# EAGLE design ZenithController (EAGLE 9.6.2)
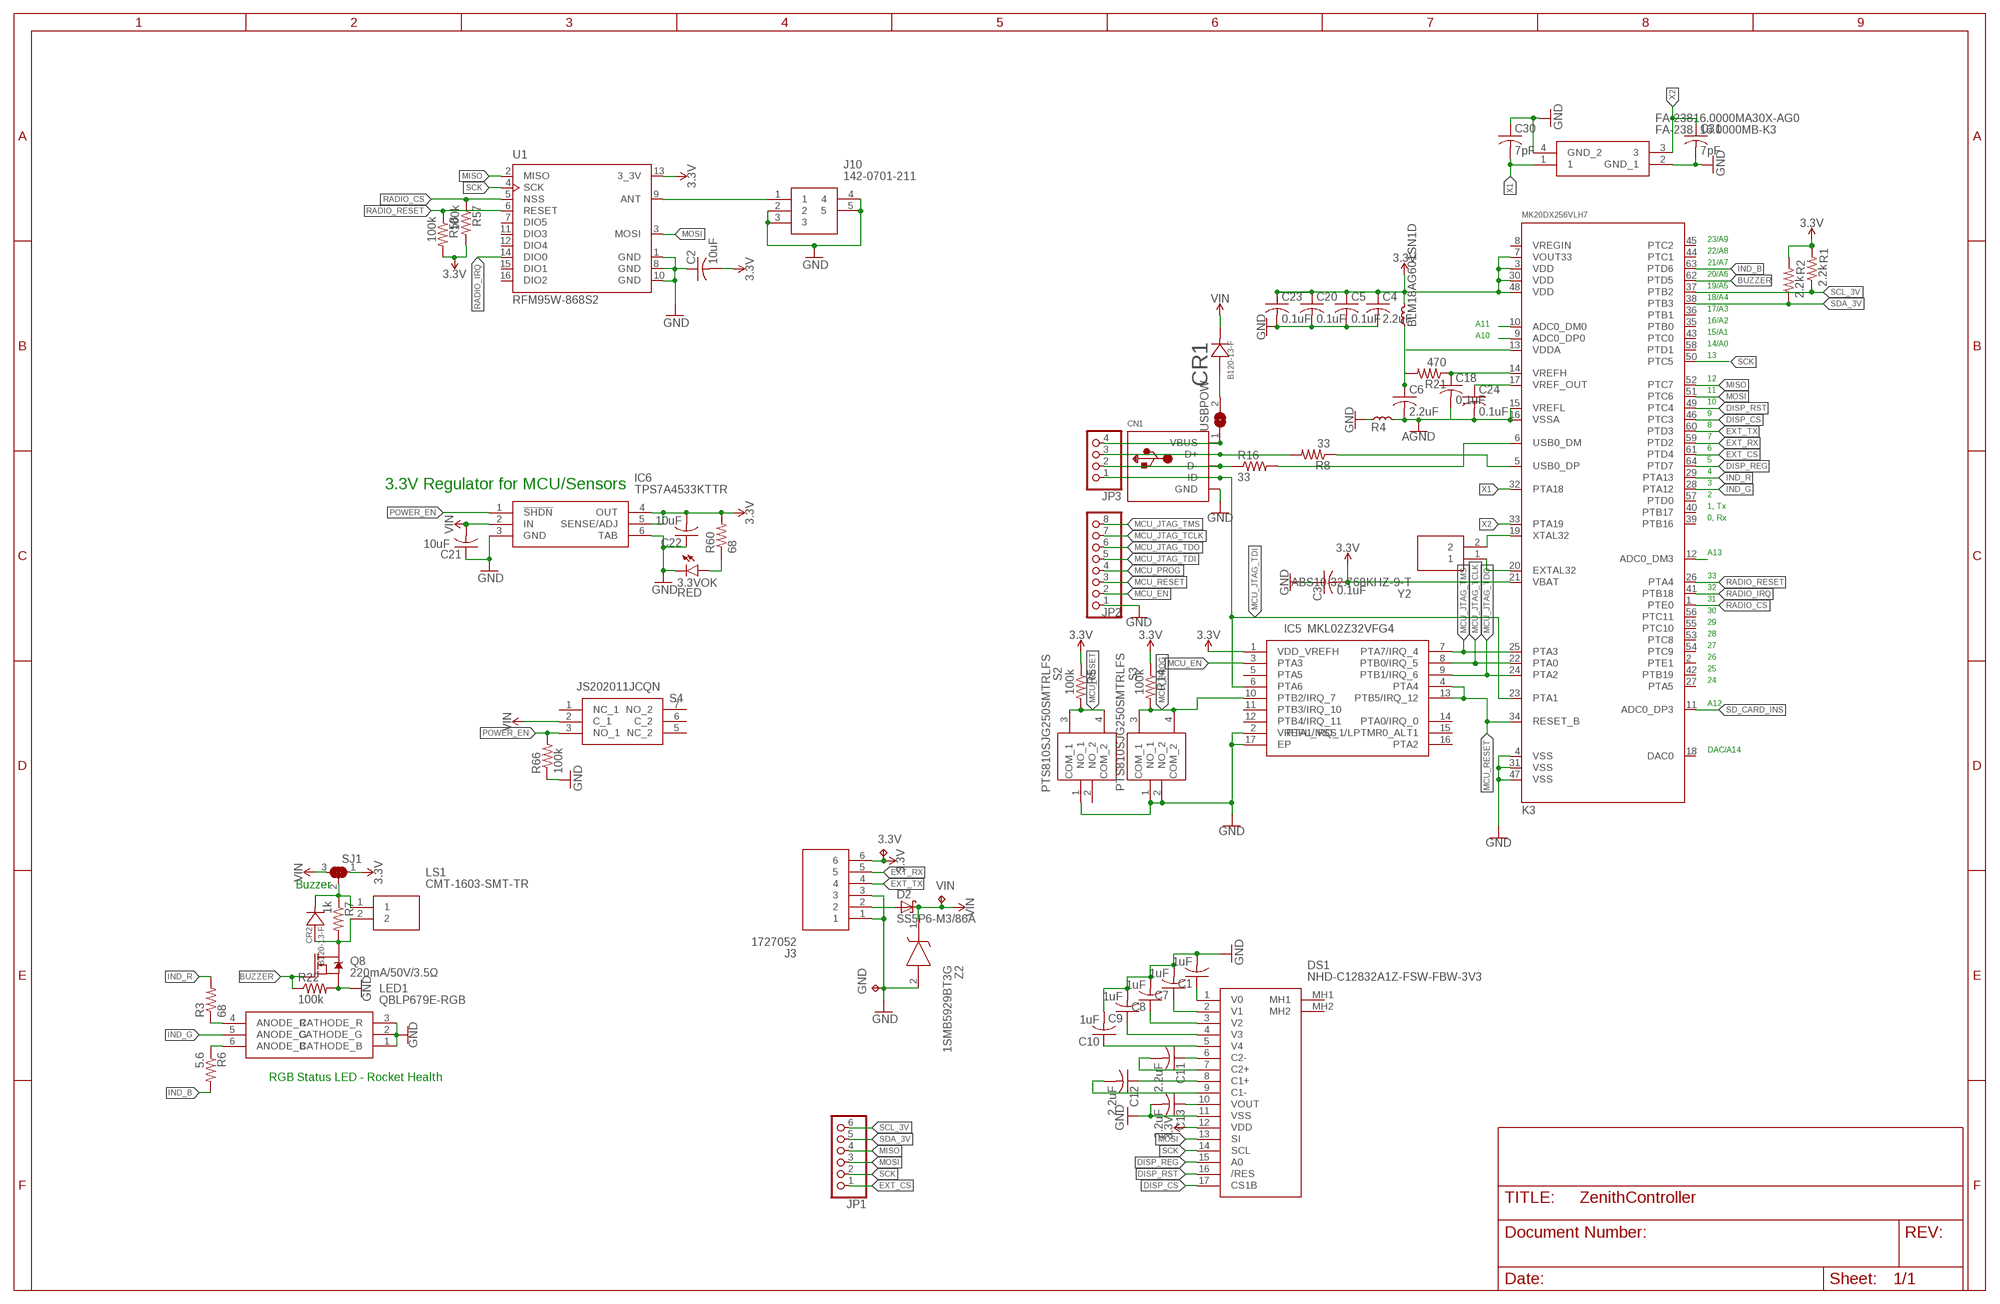
[diagram p0: schematic, sheet 1]

## Parts
3.3V  TPB1,27  [B1,27]
3.3VOK  RED  LEDCHIP-LED0805  [CHIP-LED0805]
BLM18AG601SN1D  FERRITE  [L0603]
C1  1uF  C-USC0603  [C0603]
C2  10uF  C-USC0603  [C0603]
C3  0.1uF  C-USC0603  [C0603]
C4  2.2uF  C-USC0603  [C0603]
C5  0.1uF  C-USC0603  [C0603]
C6  2.2uF  C-USC0603  [C0603]
C7  1uF  C-USC0603  [C0603]
C8  1uF  C-USC0603  [C0603]
C9  1uF  C-USC0603  [C0603]
C10  1uF  C-USC0603  [C0603]
C11  2.2uF  C-USC0603  [C0603]
C12  2.2uF  C-USC0603  [C0603]
C13  2.2uF  C-USC0603  [C0603]
C18  0.1uF  C-USC0603  [C0603]
C20  0.1uF  C-USC0603  [C0603]
C21  10uF  C-USC0603  [C0603]
C22  10uF  C-USC0603  [C0603]
C23  0.1uF  C-USC0603  [C0603]
C24  0.1uF  C-USC0603  [C0603]
C30  7pF  C-USC0603  [C0603]
C31  7pF  C-USC0603  [C0603]
CN1  USBMINIB  [USB-MINIB]
CR1  B120-13-F  [SMA_DIO]
CR2  B120-13-F  [SMA_DIO]
D2  SS5P6-M3/86A  [TO-277A(SMPC)]
DS1  NHD-C12832A1Z-FSW-FBW-3V3  [NHDC12832A1ZFSWFBW3V3]
FA-23816.0000MA30X-AG0  FA-238_16.0000MB-K3  [EPSON-FA-238]
GND  TPB1,27  [B1,27]
IC5  MKL02Z32VFG4  [QFN50P300X300X65-17N]
IC6  TPS7A4533KTTR  [KTT0005B]
J3  1727052  [SHDR6W105P0X381_1X6_2285X730X8]
J10  142-0701-211  [1420701211]
JP1  PINHD-1X6  [1X06]
JP2  PINHD-1X8  [1X08]
JP3  PINHD-1X4  [1X04]
K3  MK20DX256VLH7  [LQFP64-05]
LED1  QBLP679E-RGB  [QBLP679ERGB]
LS1  CMT-1603-SMT-TR  [CMT1603SMTTR]
Q8  220mA/50V/3.5Ω  MOSFET-NCH-BSS138  [SOT23-3]
R1  2.2k  R-US_R0603  [R0603]
R2  2.2k  R-US_R0603  [R0603]
R3  68  R-US_R0603  [R0603]
R4  FERRITE  [L0603]
R5  100k  R-US_R0603  [R0603]
R6  5.6  R-US_R0603  [R0603]
R7  1k  R-US_R0603  [R0603]
R8  33  R-US_R0603  [R0603]
R14  100k  R-US_R0603  [R0603]
R16  33  R-US_R0603  [R0603]
R21  470  R-US_R0603  [R0603]
R22  100k  R-US_R0603  [R0603]
R57  100k  R-US_R0603  [R0603]
R58  100k  R-US_R0603  [R0603]
R60  68  R-US_R0603  [R0603]
R66  100k  R-US_R0603  [R0603]
S2  PTS810SJG250SMTRLFS  [PTS810SJG250SMTRLFS]
S3  PTS810SJG250SMTRLFS  [PTS810SJG250SMTRLFS]
S4  JS202011JCQN  [JS202011JCQN]
SJ1  SOLDERJUMPER_2WAY0603  [SOLDERJUMPER_2WAY_OPEN_0603]
U1  RFM95W-868S2  [XCVR_RFM95W-868S2]
USBPOW  SJ  [SJ]
VIN  TPB1,27  [B1,27]
Y2  ABS10-32.768KHZ-9-T  [ABS-10]
Z2  1SMB5929BT3G  [DIOM5436X247N]

## Nets
3.3V [ICPower]: 3.3V.TP BLM18AG601SN1D.2 C2.2 C3.2 C4.1 C5.1 C20.1 C22.2 C23.1 DS1.12(VDD) IC5.1(VDD_VREFH) IC6.4(OUT) IC6.5(SENSE/ADJ) J3.6 K3.3(VDD) K3.7(VOUT33) K3.21(VBAT) K3.30(VDD) K3.48(VDD) R1.2 R2.2 R5.1 R14.1 R57.2 R58.2 R60.2 SJ1.1 U1.13(3_3V)
AGND: C6.2 C18.2 C24.2 K3.15(VREFL) K3.16(VSSA) R4.2
BUZZER: K3.62(PTD5) Q8.1(G) R22.1
DISP_CS: DS1.17(CS1B) K3.46(PTC3)
DISP_REG: DS1.15(A0) K3.64(PTD7)
DISP_RST: DS1.16(/RES) K3.49(PTC4)
EXT_CS: JP1.1 K3.61(PTD4)
EXT_RX: J3.5 K3.59(PTD2)
EXT_TX: J3.4 K3.60(PTD3)
GND [ICPower]: 3.3VOK.C C1.2 C2.1 C3.1 C4.2 C5.2 C7.2 C8.2 C9.2 C10.2 C13.2 C20.2 C21.1 C22.1 C23.2 C30.1 C31.2 CN1.GND DS1.11(VSS) FA-23816.0000MA30X-AG0.2(GND_1) FA-23816.0000MA30X-AG0.4(GND_2) GND.TP IC5.2(VREFL_VSS) IC5.17(EP) IC6.3(GND) IC6.6(TAB) J3.1 J3.3 J10.2 J10.3 J10.4 J10.5 JP2.1 K3.4(VSS) K3.31(VSS) K3.47(VSS) LED1.1(CATHODE_B) LED1.2(CATHODE_G) LED1.3(CATHODE_R) Q8.2(S) R4.1 R22.2 R66.1 S2.1(NO_1) S3.1(NO_1) S3.2(NO_2) U1.1(GND) U1.8(GND) U1.10(GND) Z2.2(A)
IND_B [SemiHighPower]: K3.63(PTD6) R6.2
IND_G [SemiHighPower]: K3.28(PTA12) LED1.5(ANODE_G)
IND_R [SemiHighPower]: K3.29(PTA13) R3.2
MCU_EN: IC5.3(PTA3) JP2.2
MCU_JTAG_TCLK: IC5.8(PTB0/IRQ_5) JP2.7 K3.22(PTA0)
MCU_JTAG_TDI: CN1.ID IC5.6(PTA6) JP2.5 JP3.1 K3.23(PTA1)
MCU_JTAG_TDO: IC5.9(PTB1/IRQ_6) JP2.6 K3.24(PTA2)
MCU_JTAG_TMS: IC5.7(PTA7/IRQ_4) JP2.8 K3.25(PTA3)
MCU_PROG: IC5.10(PTB2/IRQ_7) JP2.4 R14.2 S3.3(COM_1) S3.4(COM_2)
MCU_RESET: IC5.4(PTA4) IC5.13(PTB5/IRQ_12) JP2.3 K3.34(RESET_B) R5.2 S2.3(COM_1) S2.4(COM_2)
MISO: JP1.4 K3.52(PTC7) U1.2(MISO)
MOSI: DS1.13(SI) JP1.3 K3.51(PTC6) U1.3(MOSI)
N$1: C1.1 DS1.1(V0)
N$2 [SemiHighPower]: LED1.4(ANODE_R) R3.1
N$3: K3.19(XTAL32) Y2.2
N$4: BLM18AG601SN1D.1 C6.1 R21.2
N$5: C7.1 DS1.2(V1)
N$6 [SemiHighPower]: LED1.6(ANODE_B) R6.1
N$7: CR2.2 LS1.2 Q8.3(D) R7.2
N$8: J10.1 U1.9(ANT)
N$9: C8.1 DS1.3(V2)
N$10: C24.1 K3.17(VREF_OUT)
N$11: 3.3VOK.A R60.1
N$12: C9.1 DS1.4(V3)
N$13: C10.1 DS1.5(V4)
N$14: C13.1 DS1.10(VOUT)
N$15: C11.1 DS1.6(C2-)
N$16: C11.2 DS1.7(C2+)
N$17: C12.1 DS1.8(C1+)
N$18: C12.2 DS1.9(C1-)
N$21: CN1.D+ JP3.3 R8.2
N$22: CN1.D- JP3.2 R16.1
N$23: K3.5(USB0_DP) R8.1
N$24: K3.6(USB0_DM) R16.2
N$25: CR1.2 USBPOW.2
N$27: CN1.VBUS JP3.4 USBPOW.1
N$29: K3.13(VDDA)
N$30: C18.1 K3.14(VREFH) R21.1
N$35: CR2.1 LS1.1 R7.1 SJ1.2
N$36 [Pyro]: D2.A1(A) D2.A2(A) J3.2
N$37: K3.20(EXTAL32) Y2.1
N$117: K3.12(ADC0_DM3)
N$129: K3.10(ADC0_DM0)
N$130: K3.9(ADC0_DP0)
POWER_EN: IC6.1(!SHDN) R66.2 S4.3(NO_1)
RADIO_CS: K3.1(PTE0) R57.1 U1.5(NSS)
RADIO_IRQ: K3.41(PTB18) U1.14(DIO0)
RADIO_RESET: K3.26(PTA4) R58.1 U1.6(RESET)
SCK: DS1.14(SCL) JP1.2 K3.50(PTC5) U1.4(SCK)
SCL_3V: JP1.6 K3.37(PTB2) R1.1
SD_CARD_INS: K3.11(ADC0_DP3)
SDA_3V: JP1.5 K3.38(PTB3) R2.1
VIN [Pyro]: C21.2 CR1.1 D2.K(C) IC6.2(IN) S4.2(C_1) SJ1.3 VIN.TP Z2.1(K)
X1: C30.2 FA-23816.0000MA30X-AG0.1 K3.32(PTA18)
X2: C31.1 FA-23816.0000MA30X-AG0.3 K3.33(PTA19)
Unconnected: DS1.MH1 DS1.MH2 IC5.5(PTA5) IC5.11(PTB3/IRQ_10) IC5.12(PTB4/IRQ_11) IC5.14(PTA0/IRQ_0) IC5.15(PTA1/IRQ_1/LPTMR0_ALT1) IC5.16(PTA2) K3.2(PTE1) K3.8(VREGIN) K3.18(DAC0) K3.27(PTA5) K3.35(PTB0) K3.36(PTB1) K3.39(PTB16) K3.40(PTB17) K3.42(PTB19) K3.43(PTC0) K3.44(PTC1) K3.45(PTC2) K3.53(PTC8) K3.54(PTC9) K3.55(PTC10) K3.56(PTC11) K3.57(PTD0) K3.58(PTD1) S2.2(NO_2) S4.1(NC_1) S4.5(NC_2) S4.6(C_2) S4.7(NO_2) U1.7(DIO5) U1.11(DIO3) U1.12(DIO4) U1.15(DIO1) U1.16(DIO2)

## Notes on the sheet
- 23/A9
- 22/A8
- 21/A7
- 20/A6
- 19/A5
- 18/A4
- 17/A3
- 16/A2
- A11
- 15/A1
- A10
- 14/A0
- 13
- 12
- 11
- 10
- 9
- 8
- 7
- 6
- 5
- 4
- 3
- 3.3V Regulator for MCU/Sensors
- 2
- 1, Tx
- 0, Rx
- A13
- 33
- 32
- 31
- 30
- 29
- 28
- 27
- 26
- 25
- 24
- A12
- DAC/A14
- Buzzer
- RGB Status LED - Rocket Health

## Library data of the parts
3.3V GND VIN = testpad:TP: Test pad
3.3VOK = led:LED: LED OSRAM: - CHIPLED LG R971, LG N971, LY N971, LG Q971, LY Q971, LO R971, LY R971 LH N974, LH R974 LS Q976, LO Q976, LY Q976 LO Q996 - Hyper CHIPLED LW Q18S LB Q993, LB Q99A, LB R99A - SideLED LS A670, LO A670, LY A670, LG A670, LP A670 LB A673, LV A673, LT A673, LW A673 LH A674 LY A675 LS A676, LA A676, LO A676, LY A676, LW A676 LS A679, LY A679, LG A679 - Hyper Micro SIDELED® LS Y876, LA Y876, LO Y876, LY Y876 LT Y87S - SmartLED LW L88C, LW L88S LB L89C, LB L89S, LG L890 LS L89K, LO L89K, LY L89K LS L896, LA L896, LO L896, LY L896 - TOPLED LS T670, LO T670, LY T670, LG T670, LP T670 LSG T670, LSP T670, LSY T670, LOP T670, LYG T670 LG T671, LOG T671, LSG T671 LB T673, LV T673, LT T673, LW T673 LH T674 LS T676, LA T676, LO T676, LY T676, LB T676, LH T676, LSB T676, LW T676 LB T67C, LV T67C, LT T67C, LS T67K, LO T67K, LY T67K, LW E67C LS E67B, LA E67B, LO E67B, LY E67B, LB E67C, LV E67C, LT E67C LW T67C LS T679, LY T679, LG T679 LS T770, LO T770, LY T770, LG T770, LP T770 LB T773, LV T773, LT T773, LW T773 LH T774 LS E675, LA E675, LY E675, LS T675 LS T776, LA T776, LO T776, LY T776, LB T776 LHGB T686 LT T68C, LB T68C - Hyper Mini TOPLED® LB M676 - Mini TOPLED Santana® LG M470 LS M47K, LO M47K, LY M47K Source: http://www.osram.convergy.de LUXEON: - LUMILED® LXK2-PW12-R00, LXK2-PW12-S00, LXK2-PW14-U00, LXK2-PW14-V00 LXK2-PM12-R00, LXK2-PM12-S00, LXK2-PM14-U00 LXK2-PE12-Q00, LXK2-PE12-R00, LXK2-PE12-S00, LXK2-PE14-T00, LXK2-PE14-U00 LXK2-PB12-K00, LXK2-PB12-L00, LXK2-PB12-M00, LXK2-PB14-N00, LXK2-PB14-P00, LXK2-PB14-Q00 LXK2-PR12-L00, LXK2-PR12-M00, LXK2-PR14-Q00, LXK2-PR14-R00 LXK2-PD12-Q00, LXK2-PD12-R00, LXK2-PD12-S00 LXK2-PH12-R00, LXK2-PH12-S00 LXK2-PL12-P00, LXK2-PL12-Q00, LXK2-PL12-R00 Source: www.luxeon.com KINGBRIGHT: KA-3528ASYC Source: www.kingbright.com
BLM18AG601SN1D R4 = t32_ref:FERRITE; DESC: 600R / 100MHz; MF: Murata Electronics; MPN: BLM18AG601SN1D; OC_MOUSER: 81-BLM11A601S; PACKAGE: 0603; TYPE: Ferrite
C1-C13 C18 C20-C24 C30 C31 = rcl:C-US: CAPACITOR, American symbol; SPICEPREFIX: C
CN1 = adafruit:USB: USB Connectors USBMINIB - Surface Mount Female Mini-B USB Connector 4UConnector: 06564 By microbuilder.eu Thru-hole RA Female Mini-B USB Connector 4UConnector: 18732 By ladyada.net
CR1 CR2 = B120-13-F:B120-13-F; BUILT_BY: EMA_UL_Team; MANUFACTURER_PART_NUMBER: B120-13-F; SOURCELIBRARY: DiodesInc_2015-05-08; VENDOR: Diodes Inc
D2 = SS5P6-M3_86A:SS5P6-M3/86A: Vishay SS5P6-M3/86A 60V 5A; ARROW_ELECTRONICS-PURCHASE-URL: https://snapeda.com/shop?store=Arrow+Electronics&id=580592; AVAILABILITY: Unavailable; DESCRIPTION: Diode Schottky 60V 5A Surface Mount TO-277A (SMPC); DIGIKEY-PURCHASE-URL: https://snapeda.com/shop?store=DigiKey&id=580592; MF: Vishay Semiconductor; MOUSER-PURCHASE-URL: https://snapeda.com/shop?store=Mouser&id=580592; MP: SS5P6-M3/86A; PACKAGE: TO-277 Vishay Semiconductor; PRICE: None
DS1 = SamacSys_Parts:NHD-C12832A1Z-FSW-FBW-3V3: LCD Graphic Display Modules & Accessories FSTN (+) 41.4 x 24.3 x 4.0 Source: Datasheet <https://www.newhavendisplay.com/specs/NHD-C12832A1Z-FSW-FBW-3V3.pdf>; ARROW_PART_NUMBER: NHD-C12832A1Z-FSW-FBW-3V3; DESCRIPTION: LCD Graphic Display Modules & Accessories FSTN (+) 41.4 x 24.3 x 4.0; HEIGHT: 4.3mm; MANUFACTURER_NAME: Newhaven Display; MANUFACTURER_PART_NUMBER: NHD-C12832A1Z-FSW-FBW-3V3; MOUSER_PART_NUMBER: 763-C12832A1ZFSWFBW3; MOUSER_PRICE-STOCK: https://www.mouser.co.uk/ProductDetail/Newhaven-Display/NHD-C12832A1Z-FSW-FBW-3V3?qs=Vb5qD4CGh4nSmlh9l2%252Byrw%3D%3D
FA-23816.0000MA30X-AG0 = SamacSys_Parts:FA-238_16.0000MB-K3: Crystal 16MHz Source: Datasheet <https://support.epson.biz/td/api/doc_check.php?dl=brief_fa-238v_en.pdf>; ARROW_PART_NUMBER: FA-238 16.0000MB-K3; ARROW_PRICE-STOCK: https://www.arrow.com/en/products/fa-23816.0000mb-k3/epson-electronics-america; DESCRIPTION: Crystal 16MHz; HEIGHT: mm; MANUFACTURER_NAME: Epson Timing; MANUFACTURER_PART_NUMBER: FA-238 16.0000MB-K3; MOUSER_PART_NUMBER: 732-FA238-16B-K3; MOUSER_PRICE-STOCK: https://www.mouser.co.uk/ProductDetail/Epson-Timing/FA-238-160000MB-K3?qs=CANAagUtPAoF3w0fRAI0xg%3D%3D
IC5 = SamacSys_Parts:MKL02Z32VFG4: NXP MKL02Z32VFG4, 32bit ARM Cortex M0 Microcontroller, 48MHz, 32 kB Flash, 16-Pin QFN Source: Datasheet <http://www.nxp.com/docs/en/data-sheet/KL02P32M48SF0.pdf>; ARROW_PART_NUMBER: MKL02Z32VFG4; ARROW_PRICE-STOCK: https://www.arrow.com/en/products/mkl02z32vfg4/nxp-semiconductors; DESCRIPTION: NXP MKL02Z32VFG4, 32bit ARM Cortex M0 Microcontroller, 48MHz, 32 kB Flash, 16-Pin QFN; HEIGHT: 0.65mm; MANUFACTURER_NAME: NXP; MANUFACTURER_PART_NUMBER: MKL02Z32VFG4; MOUSER_PART_NUMBER: 841-MKL02Z32VFG4; MOUSER_PRICE-STOCK: https://www.mouser.co.uk/ProductDetail/NXP-Semiconductors/MKL02Z32VFG4?qs=RECgZY%252BK1xLpPFD7GzHxWg%3D%3D
IC6 = SamacSys_Parts:TPS7A4533KTTR: Low-Noise Fast-Transient-Response 1.5-A Low-Dropout Voltage Regulators Source: Datasheet <http://www.ti.com/lit/gpn/tps7a45>; ARROW_PART_NUMBER: TPS7A4533KTTR; ARROW_PRICE-STOCK: https://www.arrow.com/en/products/tps7a4533kttr/texas-instruments; DESCRIPTION: Low-Noise Fast-Transient-Response 1.5-A Low-Dropout Voltage Regulators; HEIGHT: mm; MANUFACTURER_NAME: Texas Instruments; MANUFACTURER_PART_NUMBER: TPS7A4533KTTR; MOUSER_PART_NUMBER: 595-TPS7A4533KTTR; MOUSER_PRICE-STOCK: https://www.mouser.co.uk/ProductDetail/Texas-Instruments/TPS7A4533KTTR?qs=VdEABdpqjWy1AK9ieQmsYg%3D%3D
J3 = SamacSys_Parts:1727052: PHOENIX CONTACT - 1727052 - TERMINAL BLOCK, WIRE TO BRD, 6POS, 16AWG Source: Datasheet <https://www.phoenixcontact.com/online/portal/gb/?uri=pxc-oc-itemdetail:pid=1727052&library=gben&pcck=P-11-01-05&tab=1&selectedCategory=ALL>; ARROW_PART_NUMBER: 1727052; ARROW_PRICE-STOCK: https://www.arrow.com/en/products/1727052/phoenix-contact; DESCRIPTION: PHOENIX CONTACT - 1727052 - TERMINAL BLOCK, WIRE TO BRD, 6POS, 16AWG; HEIGHT: 8.65mm; MANUFACTURER_NAME: Phoenix Contact; MANUFACTURER_PART_NUMBER: 1727052; MOUSER_PART_NUMBER: 651-1727052; MOUSER_PRICE-STOCK: https://www.mouser.co.uk/ProductDetail/Phoenix-Contact/1727052?qs=WWq3Ki8dym7VpMyTMk0i8A%3D%3D
J10 = SamacSys_Parts:142-0701-211: Cinch Connectors Straight 50 PCB Mount SMA Connector, jack, Solder Termination Source: Datasheet <https://media.digikey.com/pdf/Data Sheets/Emerson PDFs/142-0701-211, 216, 217.pdf>; ARROW_PART_NUMBER: 142-0701-211; ARROW_PRICE-STOCK: https://www.arrow.com/en/products/142-0701-211/cinch-connectivity-solutions; DESCRIPTION: Cinch Connectors Straight 50 PCB Mount SMA Connector, jack, Solder Termination; HEIGHT: 9.652mm; MANUFACTURER_NAME: Cinch Connectivity Solutions; MANUFACTURER_PART_NUMBER: 142-0701-211; MOUSER_PART_NUMBER: 530-1420701211; MOUSER_PRICE-STOCK: https://www.mouser.co.uk/ProductDetail/Johnson-Cinch-Connectivity-Solutions/142-0701-211?qs=VqHsQWpF6ulG8WyKOf%2FLqg%3D%3D
JP1 = pinhead:PINHD-1X6: PIN HEADER
JP2 = pinhead:PINHD-1X8: PIN HEADER
JP3 = pinhead:PINHD-1X4: PIN HEADER
K3 = t32_ref:MK20DX256VLH7; DESC: MK20DX256VLH7; MF: NXP; MPN: MK20DX256VLH7; OC_MOUSER: 841-MK20DX256VLH7; PACKAGE: LQFP-64; TYPE: Microcontroller
LED1 = SamacSys_Parts:QBLP679E-RGB: LED RGB DIFFUSED 6PLCC SMD Source: Datasheet <http://www.qt-brightek.com/datasheet/QBLP679E-RGB.pdf>; ARROW_PART_NUMBER: QBLP679E-RGB; DESCRIPTION: LED RGB DIFFUSED 6PLCC SMD; HEIGHT: 1.8mm; MANUFACTURER_NAME: QT Brightek (QTB); MANUFACTURER_PART_NUMBER: QBLP679E-RGB
LS1 = SamacSys_Parts:CMT-1603-SMT-TR: AUDIO PIEZO TRANSDUCER 25V SMD Source: Datasheet <https://componentsearchengine.com/Datasheets/1/CMT-1603-SMT-TR.pdf>; ARROW_PART_NUMBER: CMT-1603-SMT-TR; ARROW_PRICE-STOCK: https://www.arrow.com/en/products/cmt-1603-smt-tr/cui-devices; DESCRIPTION: AUDIO PIEZO TRANSDUCER 25V SMD; HEIGHT: 2.8mm; MANUFACTURER_NAME: CUI Devices; MANUFACTURER_PART_NUMBER: CMT-1603-SMT-TR; MOUSER_PART_NUMBER: 490-CMT-1603-SMT-TR; MOUSER_PRICE-STOCK: https://www.mouser.co.uk/ProductDetail/CUI-Devices/CMT-1603-SMT-TR?qs=WyjlAZoYn50AZ4xT4ox6zw%3D%3D
Q8 = SparkFun-DiscreteSemi:MOSFET-NCH: N-channel MOSFETs Voltage controlled devices that allow control of high current outputs. SparkFun Products: SparkFun OpenScale <https://www.sparkfun.com/products/13261> SparkFun Digital Sandbox <https://www.sparkfun.com/products/12651> SparkFun Monster Moto Shield <https://www.sparkfun.com/products/10182> SparkFun MOSFET Power Controller <https://www.sparkfun.com/products/11214>; PROD_ID: TRANS-00830
R1-R3 R5-R8 R14 R16 R21 R22 R57 R58 R60 R66 = rcl:R-US_: RESISTOR, American symbol; SPICEPREFIX: R
S2 S3 = SamacSys_Parts:PTS810SJG250SMTRLFS: PTS810SJG250SMTRLFS (Tactile Switches) Switch Tactile N.O. SPST Button J-Bend 0.05A 16VDC 100000Cycles 3.92N SMD T/R Source: Datasheet <https://www.ckswitches.com/media/1476/pts810.pdf>; ARROW_PART_NUMBER: PTS810SJG250SMTRLFS; DESCRIPTION: PTS810SJG250SMTRLFS (Tactile Switches) Switch Tactile N.O. SPST Button J-Bend 0.05A 16VDC 100000Cycles 3.92N SMD T/R; HEIGHT: 2.7mm; MANUFACTURER_NAME: C & K COMPONENTS; MANUFACTURER_PART_NUMBER: PTS810SJG250SMTRLFS; MOUSER_PART_NUMBER: 611-PTS810SJG250SMTR; MOUSER_PRICE-STOCK: https://www.mouser.co.uk/ProductDetail/CK/PTS810SJG250SMTRLFS?qs=UxeAxwACbqndUPIQjZosiw%3D%3D
S4 = SamacSys_Parts:JS202011JCQN: Slide Switch DPDT Surface Mount Source: Datasheet <https://www.ckswitches.com/media/1422/js.pdf>; ARROW_PART_NUMBER: JS202011JCQN; ARROW_PRICE-STOCK: https://www.arrow.com/en/products/js202011jcqn/ck; DESCRIPTION: Slide Switch DPDT Surface Mount; HEIGHT: 5mm; MANUFACTURER_NAME: C & K COMPONENTS; MANUFACTURER_PART_NUMBER: JS202011JCQN; MOUSER_PART_NUMBER: 611-JS202011JCQN; MOUSER_PRICE-STOCK: https://www.mouser.co.uk/ProductDetail/CK/JS202011JCQN?qs=74EMXstkWMXJzVJFnXPbEg%3D%3D
SJ1 = microbuilder:SOLDERJUMPER_2WAY: 2-Way Solder Jumper
U1 = RFM95W-868S2:RFM95W-868S2: Mod Txrx Lora +20dbm 868mhz Smd; AVAILABILITY: Unavailable; DESCRIPTION: General ISM < 1GHz LoRa™ Transceiver Module 868MHz Antenna Not Included Surface Mount; MF: RF; MP: RFM95W-868S2; PACKAGE: SMD-16 Hope Microelectronics; PRICE: None
USBPOW = jumper:SJ: SMD solder JUMPER
Y2 = SamacSys_Parts:ABS10-32.768KHZ-9-T: ABRACON - ABS10-32.768KHZ-9-T - Crystal, 32.768 kHz, SMD, 4.9mm x 1.8mm, 9 pF, 20 ppm, ABS10 Series Source: Datasheet <https://abracon.com/Resonators/ABS10.pdf>; ARROW_PART_NUMBER: ABS10-32.768KHZ-9-T; ARROW_PRICE-STOCK: https://www.arrow.com/en/products/abs10-32.768khz-9-t/abracon; DESCRIPTION: ABRACON - ABS10-32.768KHZ-9-T - Crystal, 32.768 kHz, SMD, 4.9mm x 1.8mm, 9 pF, 20 ppm, ABS10 Series; HEIGHT: mm; MANUFACTURER_NAME: ABRACON; MANUFACTURER_PART_NUMBER: ABS10-32.768KHZ-9-T; MOUSER_PART_NUMBER: 815-ABS10-32.768K9T; MOUSER_PRICE-STOCK: https://www.mouser.co.uk/ProductDetail/ABRACON/ABS10-32768KHZ-9-T?qs=76dmnhCH%2FMO8FcjiLkcQ2w%3D%3D
Z2 = SamacSys_Parts:1SMB5929BT3G: ON Semiconductor, 15V Zener Diode 5% 550 mW SMT 2-Pin SMB Source: Datasheet <https://www.onsemi.com/pub/Collateral/1SMB5913BT3-D.PDF>; ARROW_PART_NUMBER: 1SMB5929BT3G; ARROW_PRICE-STOCK: https://www.arrow.com/en/products/1smb5929bt3g/on-semiconductor; DESCRIPTION: ON Semiconductor, 15V Zener Diode 5% 550 mW SMT 2-Pin SMB; HEIGHT: 2.47mm; MANUFACTURER_NAME: ON Semiconductor; MANUFACTURER_PART_NUMBER: 1SMB5929BT3G; MOUSER_PART_NUMBER: 863-1SMB5929BT3G; MOUSER_PRICE-STOCK: https://www.mouser.co.uk/ProductDetail/ON-Semiconductor/1SMB5929BT3G?qs=vLkC5FC1VN%2FFUr7OS2Q1Aw%3D%3D

## Net classes
0 default: width 0.152 mm
2 ICPower: width 0.152 mm
3 Pyro: width 0.152 mm
4 SemiHighPower: width 0.152 mm

## Board
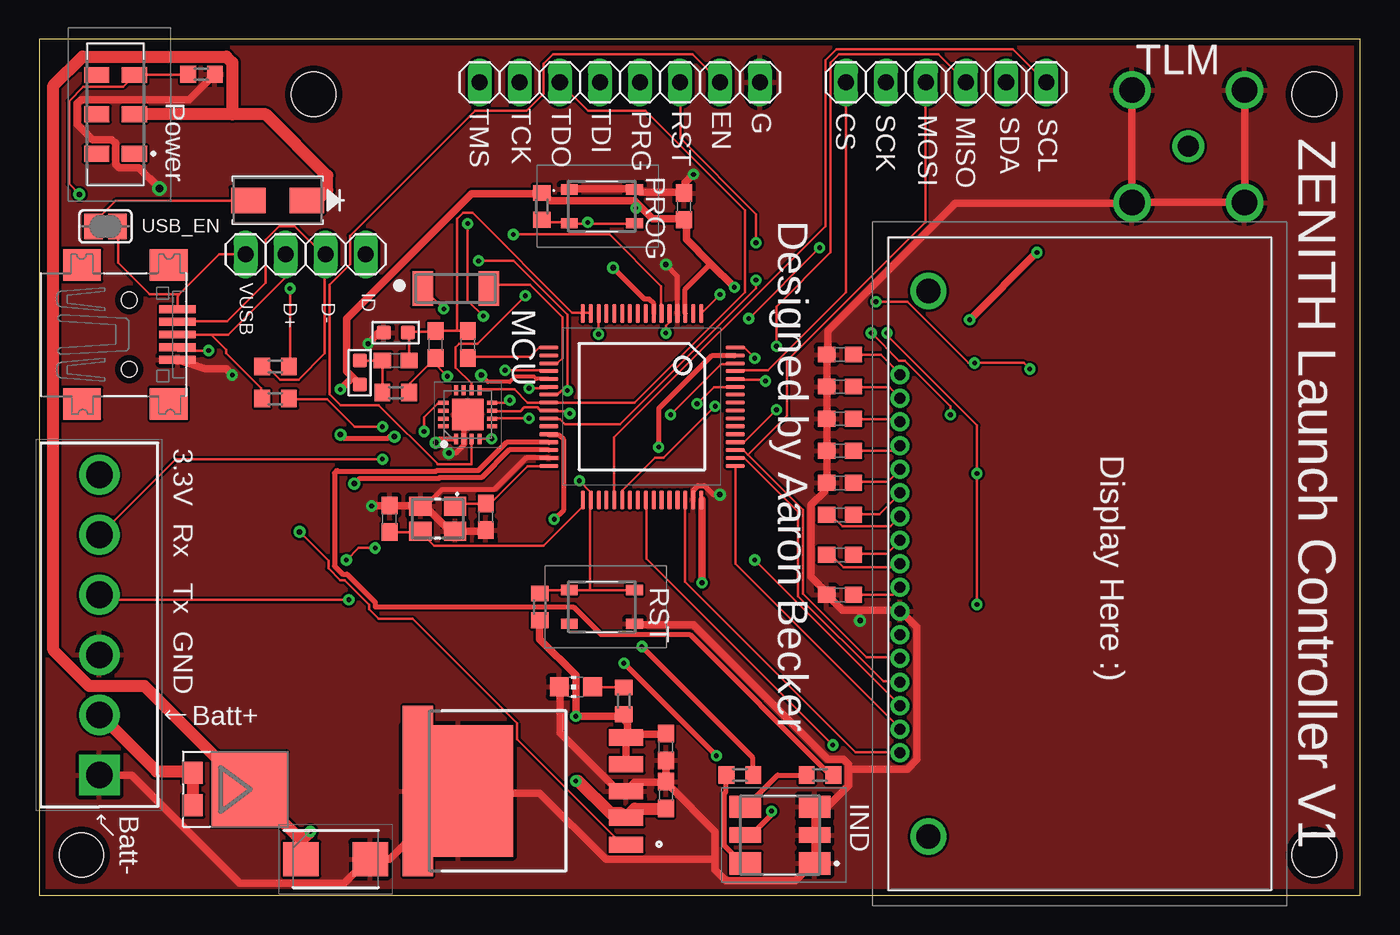
[diagram p1: board, top side]
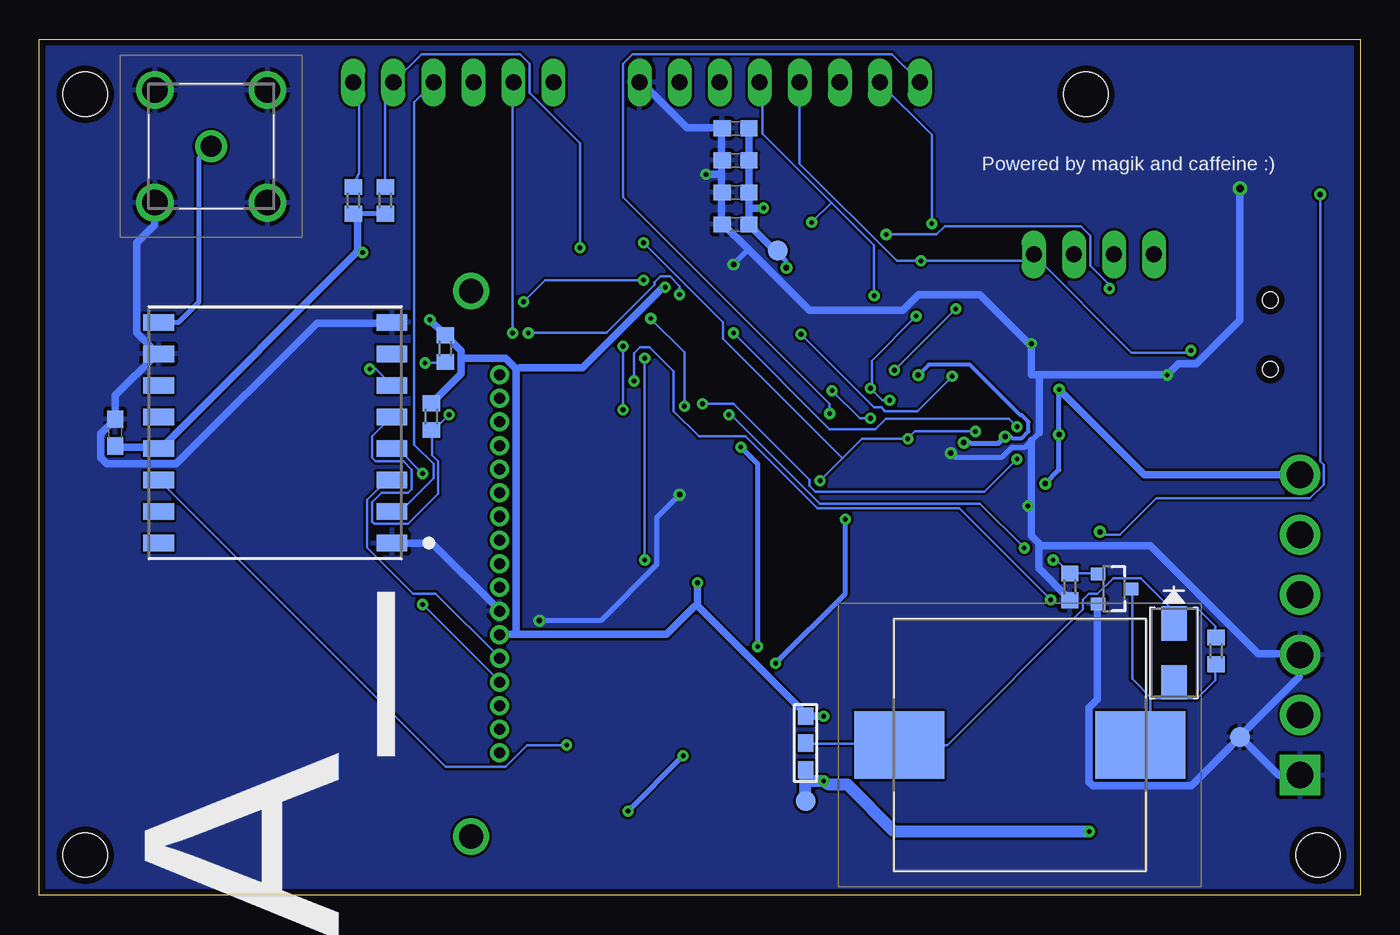
[diagram p2: board, bottom side, seen from below]

Size 83.8 x 54.28 mm. Coordinates in mm from the lower left corner, seen from the top.
Outline: 0,0 83.8,0 83.8,54.28 0,54.28 0,0
Copper layers (1*16): Top 0.035mm / dielectric 1.5mm / Bottom 0.035mm
Design rules "default *": minimum track width 6mil, minimum drill 0.3mm, track to track 6mil, track to pad 6mil, pad to pad 5mil, via to via 10mil, smd to smd 5mil, copper to edge 0.4mm, drill to drill 10mil, minimum pad ring 10mil, minimum via ring 8mil, stop-mask expansion 4mil, vias tented up to drill 0mil, thermal gap 10mil
Holes 2.8 mm at 2.67,2.54 80.9,2.54 17.4,50.8 80.9,50.8

### Footprints (pad centres in the part's own frame; a part is rotated, then mirrored left to right if it is on the bottom)
B1,27 = smd 1.27 x 1.27: TP 0,0
CHIP-LED0805 = smd 1.2 x 1.2: A 0,-1.05; C 0,1.05
L0603 = smd 0.889 x 0.889: 1 -0.762,0; 2 0.762,0
C0603 = smd 1.1 x 1: 1 -0.85,0; 2 0.85,0
USB-MINIB = smd 0.5 x 2.308: D+ 0,4.064; D- -0.8,4.064; GND 1.6,4.064; ID 0.8,4.064; VBUS -1.6,4.064 | smd 2 x 2.4: GND1 -4.4,-2; GND2 -4.4,3.5; GND3 4.4,3.5; GND4 4.4,-2 | hole 1: -2.2,1; 2.2,1
SMA_DIO = smd 2.18 x 1.63: 1 -1.857,0; 2 1.857,0
TO-277A(SMPC) = smd 1.4 x 1.3: A1 -1.04,-2.725; A2 1.04,-2.725 | smd 4.72 x 4.8: K 0,0.875
NHDC12832A1ZFSWFBW3V3 = drill 0.7 pad 1.2: 1 0,0; 2 1.5,0; 3 3,0; 4 4.5,0; 5 6,0; 6 7.5,0; 7 9,0; 8 10.5,0; 9 12,0; 10 13.5,0; 11 15,0; 12 16.5,0; 13 18,0; 14 19.5,0; 15 21,0; 16 22.5,0; 17 24,0 | drill 1.54 pad 2.31: MH1 -5.3,1.8; MH2 29.3,1.8
EPSON-FA-238 = smd 1.4 x 1.2: 1 -1.1,-0.8; 2 1.1,-0.8; 3 1.1,0.8; 4 -1.1,0.8
QFN50P300X300X65-17N = smd 0.65 x 0.25: 1 -1.55,0.75; 2 -1.55,0.25; 3 -1.55,-0.25; 4 -1.55,-0.75; 9 1.55,-0.75; 10 1.55,-0.25; 11 1.55,0.25; 12 1.55,0.75 | smd 0.25 x 0.65: 5 -0.75,-1.55; 6 -0.25,-1.55; 7 0.25,-1.55; 8 0.75,-1.55; 13 0.75,1.55; 14 0.25,1.55; 15 -0.25,1.55; 16 -0.75,1.55 | smd 2 x 2: 17 0,0
KTT0005B = smd 2.16 x 1.02: 1 12.461,-3.4; 2 12.461,-1.7; 3 12.461,0; 4 12.461,1.7; 5 12.461,3.4 | smd 6.99 x 8.33: 6 1.786,0 | smd 1.91 x 1.235: 7 -0.754,4.782; 8 -0.754,-4.782
SHDR6W105P0X381_1X6_2285X730X8 = drill 1.7 pad 2.55 square: 1 0,0 | drill 1.7 pad 2.55: 2 3.81,0; 3 7.62,0; 4 11.43,0; 5 15.24,0; 6 19.05,0
1420701211 = drill 1.346 pad 2.019: 1 0,0 | drill 1.6 pad 2.4: 2 -3.569,3.569; 3 -3.569,-3.569; 4 3.569,-3.569; 5 3.569,3.569
1X06 = drill 1.016 long: 1 -6.35,0; 2 -3.81,0; 3 -1.27,0; 4 1.27,0; 5 3.81,0; 6 6.35,0
1X08 = drill 1.016 long: 1 -8.89,0; 2 -6.35,0; 3 -3.81,0; 4 -1.27,0; 5 1.27,0; 6 3.81,0; 7 6.35,0; 8 8.89,0
1X04 = drill 1.016 long: 1 -3.81,0; 2 -1.27,0; 3 1.27,0; 4 3.81,0
LQFP64-05 = smd 1.2 x 0.25: 1 -5.915,3.759; 2 -5.915,3.251; 3 -5.915,2.743; 4 -5.915,2.261; 5 -5.915,1.753; 6 -5.915,1.245; 7 -5.915,0.762; 8 -5.915,0.254; 9 -5.915,-0.254; 10 -5.915,-0.762; 11 -5.915,-1.245; 12 -5.915,-1.753; 13 -5.915,-2.261; 14 -5.915,-2.743; 15 -5.915,-3.251; 16 -5.915,-3.759; 33 5.915,-3.759; 34 5.915,-3.251; 35 5.915,-2.743; 36 5.915,-2.261; 37 5.915,-1.753; 38 5.915,-1.245; 39 5.915,-0.762; 40 5.915,-0.254; 41 5.915,0.254; 42 5.915,0.762; 43 5.915,1.245; 44 5.915,1.753; 45 5.915,2.261; 46 5.915,2.743; 47 5.915,3.251; 48 5.915,3.759 | smd 0.25 x 1.2: 17 -3.759,-5.915; 18 -3.251,-5.915; 19 -2.743,-5.915; 20 -2.261,-5.915; 21 -1.753,-5.915; 22 -1.245,-5.915; 23 -0.762,-5.915; 24 -0.254,-5.915; 25 0.254,-5.915; 26 0.762,-5.915; 27 1.245,-5.915; 28 1.753,-5.915; 29 2.261,-5.915; 30 2.743,-5.915; 31 3.251,-5.915; 32 3.759,-5.915; 49 3.759,5.915; 50 3.251,5.915; 51 2.743,5.915; 52 2.261,5.915; 53 1.753,5.915; 54 1.245,5.915; 55 0.762,5.915; 56 0.254,5.915; 57 -0.254,5.915; 58 -0.762,5.915; 59 -1.245,5.915; 60 -1.753,5.915; 61 -2.261,5.915; 62 -2.743,5.915; 63 -3.251,5.915; 64 -3.759,5.915
QBLP679ERGB = smd 2 x 1.4: 1 2.2,-1.8; 3 2.2,1.8; 4 -2.2,1.8; 6 -2.2,-1.8 | smd 2 x 1: 2 2.2,0; 5 -2.2,0
CMT1603SMTTR = smd 5.7 x 4.3: 1 -7.65,0; 2 7.65,0
SOT23-3 = smd 0.8 x 0.9: 1 -0.95,-1; 2 0.95,-1; 3 0,1.1
R0603 = smd 1 x 1.1: 1 -0.85,0; 2 0.85,0
PTS810SJG250SMTRLFS = smd 1.05 x 0.65: 1 -2.075,1.075; 2 2.075,1.075; 3 -2.075,-1.075; 4 2.075,-1.075
JS202011JCQN = smd 1 x 1.6: 1 -2.5,-0.95; 2 0,-0.95; 3 2.5,-0.95; 5 2.5,1.45; 6 0,1.45; 7 -2.5,1.45
SOLDERJUMPER_2WAY_OPEN_0603 = smd 1.1 x 1: 1 -1.7,0; 2 0,0; 3 1.7,0
XCVR_RFM95W-868S2 = smd 1.95 x 1.05: 1 -7.4,7; 2 -7.4,5; 3 -7.4,3; 4 -7.4,1; 5 -7.4,-1; 6 -7.4,-3; 7 -7.4,-5; 8 -7.4,-7; 9 7.4,-7; 10 7.4,-5; 11 7.4,-3; 12 7.4,-1; 13 7.4,1; 14 7.4,3; 15 7.4,5; 16 7.4,7
SJ = smd 1.168 x 1.6: 1 -0.762,0; 2 0.762,0
ABS-10 = smd 1.3 x 2.2: 1 -2.1,0; 2 2.1,0
DIOM5436X247N = smd 2.25 x 2.15: 1 -2.2,0; 2 2.2,0

### Placement (x,y rotation side)
3.3V  36.96,40.89 0 bottom
3.3VOK  34.04,13.21 90 top
BLM18AG601SN1D  20.32,33.15 270 top
C1  50.8,34.29 180 top
C2  78.99,29.34 270 bottom
C3  40.89,43.69 270 top
C4  39.62,46.61 180 bottom
C5  39.62,48.64 180 bottom
C6  22.61,33.91 0 top
C7  50.8,32.26 180 top
C8  50.8,30.23 180 top
C9  50.8,28.19 180 top
C10  50.8,26.16 180 top
C11  50.8,24.13 180 top
C12  50.8,21.59 180 top
C13  50.8,19.05 180 top
C18  25.15,34.92 90 top
C20  39.62,44.58 180 bottom
C21  39.75,6.35 270 top
C22  39.75,9.4 90 top
C23  39.62,42.55 180 bottom
C24  27.18,34.92 90 top
C30  28.32,24 90 top
C31  22.22,23.88 90 top
CN1  4.7,35.56 270 top
CR1  15.11,44.07 180 top
CR2  11.81,15.37 270 bottom
D2  12.45,6.73 270 top
DS1  54.61,33.02 270 top
FA-23816.0000MA30X-AG0  25.27,23.88 180 top
GND  7.62,10.03 0 bottom
IC5  27.18,30.48 90 top
IC6  24.77,6.6 0 top
J3  3.81,7.62 90 top
J10  72.9,47.5 0 bottom
JP1  57.53,51.56 0 top
JP2  36.83,51.56 180 top
JP3  16.89,40.64 180 top
K3  38.23,30.99 270 top
LED1  46.99,3.81 0 top
LS1  21.59,9.53 0 bottom
Q8  15.62,19.43 270 bottom
R1  63.88,44.07 270 bottom
R2  61.85,44.07 270 bottom
R3  49.53,7.62 0 top
R4  22.61,35.69 0 top
R5  31.75,18.29 90 top
R6  44.45,7.62 0 top
R7  9.14,15.49 270 bottom
R8  14.99,31.5 180 top
R14  31.88,43.69 270 top
R16  14.99,33.53 0 top
R21  22.61,31.88 180 top
R22  18.41,19.56 270 bottom
R57  58.93,30.35 90 bottom
R58  58.04,34.67 90 bottom
R60  37.08,12.32 270 top
R66  10.29,52.07 180 top
S2  35.69,18.29 180 top
S3  35.69,43.69 0 top
S4  5.08,49.53 90 top
SJ1  35.18,9.65 270 bottom
U1  68.83,29.34 180 bottom
USBPOW  4.19,42.42 180 top
VIN  35.18,5.97 0 bottom
Y2  26.42,38.48 0 top
Z2  18.8,2.29 0 top

### Tracks (layer width: path | path; a pad name or v marks a point on that pad's centre or on a via)
3.3V  (via drill 0.3, 0.35)
  Top 0.254: K3.21 31.52,32.74 31.37,32.89 30.17,32.89 29.84,32.56 28.46,32.56 v28.03,32.99
  Top 0.305: 42.04,25.07 K3.48 | K3.30 29.81,28.25 28.05,26.49 25.4,26.49 25.34,26.43 20.31,26.43 v19.98,26.1 | IC5.1 25.37,28.93 v25.15,28.7 | v22.53,29.08 22.21,29.08 22.08,28.96 19.35,28.96 v19.1,29.21 | K3.3 40.97,38.43 42.6,40.06 | v36.4,39.8 38.39,37.81 38.69,37.81 38.99,37.51 K3.7
  Top 0.483: 19.86,32.84 19.48,33.22 19.48,36.58 27.41,44.5 31.83,44.5 R14.1 32.05,44.42 32.44,44.04 37.77,44.04 38,43.81 | 19.86,32.84 BLM18AG601SN1D.2 | 38,43.81 38.91,42.9 40.89,42.9 C3.2 41.05,42.67 41.05,41.6 42.6,40.06 v44.09,38.56 | v37.85,43.59 37.85,43.66 38,43.81 | 19.86,32.84 v19.1,32.08 | C22.2 39.75,10.21 37.39,10.21 37.24,10.06 IC6.5 | IC6.4 37.24,9.83 IC6.5 | R5.1 31.75,16.23 34.04,13.95 v34.04,11.35 37.01,11.35 37.08,11.43 R60.2 37.08,11.12 37.31,10.9 37.31,10.44 IC6.5 | v42.04,19.81 42.04,25.07 | v59.03,36.5 v63.3,40.77
  Bottom 0.254: v22.53,29.08 22.17,29.08 22.07,28.98 21.46,28.98 21.03,29.41 21.03,30.02 21.46,30.45 21.56,30.45 24.76,33.65 27.37,33.65 v28.03,32.99
  Bottom 0.305: v19.98,26.1 19.1,26.98 v19.1,29.21 v19.1,32.08 | v25.15,28.7 24.77,28.7 24.72,28.65 22.96,28.65 v22.53,29.08 | v36.4,39.8 36.4,40.16 37.16,40.92 | R2.2 R1.2
  Bottom 0.483: 38.76,43.59 C20.1 38.76,44.81 38.76,46.56 C4.1 38.76,46.79 38.76,48.62 C5.1 | 38.76,43.59 38.76,42.6 C23.1 38.61,42.37 37.16,40.92 37.01,40.92 3.3V.TP | v37.85,43.59 38.76,43.59 | J3.6 13.69,26.67 v19.1,32.08 | C2.2 78.99,28.42 76.33,28.42 76.25,28.35 U1.13 76.02,28.42 63.6,40.84 | 63.6,40.84 63.6,42.62 R1.2 | 57.05,34.06 57.05,34.52 R58.2 58.19,35.66 v59.03,36.5 | 57.05,34.06 57.05,33.07 58.88,31.24 R57.2 | v34.04,11.35 SJ1.1 35.26,11.58 42.04,18.36 | 42.04,18.36 v42.04,19.81 | 53.54,16.54 44.02,16.54 42.27,18.29 42.04,18.36 | 53.54,16.54 54.61,16.54 DS1.12 | 57.05,34.06 54.23,34.06 53.54,33.38 | 53.54,16.54 53.54,33.38 | v63.3,40.77 63.37,40.77 63.6,40.84 | v44.09,38.56 44.25,38.56 49.35,33.45 53.32,33.45 53.54,33.38
AGND
  Top 0.152: K3.15 34.95,36.96 34.49,36.96 K3.16 34.42,36.96 33.81,36.96 27.48,43.28 26.87,43.28 26.49,42.9 26.49,35.81 | 23.44,35.74 25.12,35.74 C18.2 25.2,35.81 26.49,35.81 | 23.44,35.74 23.37,35.74 R4.2 23.44,35.74 | 23.44,35.74 23.44,33.91 C6.2 | 26.49,35.81 27.18,35.81 C24.2
BUZZER  (via drill 0.3)
  Top 0.152: v40.06,30.48 43.26,33.68 44.09,33.68 K3.62 | v21.31,22.02 20.24,22.02 v19.48,21.26
  Bottom 0.152: 18.41,20.42 16.66,20.42 Q8.1 | v40.06,30.48 39.9,30.48 34.27,24.84 24.13,24.84 v21.31,22.02 | v19.48,21.26 19.25,21.26 18.41,20.42 | 18.41,20.42 R22.1
DISP_CS
  Top 0.152: K3.46 40.97,19.89 51.79,9.07 54.61,9.07 DS1.17
DISP_REG  (via drill 0.3)
  Top 0.152: K3.64 44.7,34.75 v45.39,34.06 | v45.39,21.26 54.61,12.04 DS1.15
  Bottom 0.152: v45.39,21.26 v45.39,34.06
DISP_RST
  Top 0.152: K3.49 44.17,27.2 44.17,21.03 54.61,10.59 DS1.16
EXT_CS
  Top 0.152: JP1.1 51.18,38.25 46.23,33.3 44.17,33.3 K3.61
EXT_RX  (via drill 0.3)
  Top 0.152: K3.59 42.8,32.23 v41.73,31.17 | v21.77,27.66 8.66,27.66 3.86,22.86 J3.5
  Bottom 0.152: v41.73,31.17 39.75,31.17 34.95,26.36 34.95,25.98 34.57,25.6 23.82,25.6 v21.77,27.66
EXT_TX  (via drill 0.3)
  Top 0.152: v46.08,32.61 46,32.69 44.17,32.69 K3.60 | v19.63,18.75 4.17,18.75 3.86,19.05 J3.4
  Bottom 0.152: v46.08,32.61 46.08,34.37 45.7,34.75 45.09,34.75 43.56,33.22 43.56,30.71 41.96,29.11 38.99,29.11 34.42,24.54 25.43,24.54 v19.63,18.75
GND  (via drill 0.3, 0.35, 0.5)
  Top 0.305: K3.47 41.49,25.09 41.49,25.69 41.78,25.98 42.19,25.98 42.77,25.4 v43.18,25.4 | v52.07,17.41 52.07,18.06 | IC5.17 26.93,30.23 IC5.2 26.98,28.87 26.98,28.61 26.42,28.04 v25.97,28.04 | K3.31 30.86,27.74 28.86,25.73 25.55,25.73 24.36,24.54 | K3.4 40.49,39.27 v39.75,40.01
  Top 0.483: R66.1 11.1,52.05 9.5,50.44 2.64,50.44 2.41,50.22 2.41,48.89 3.38,47.92 4.59,47.92 4.84,47.68 4.84,46.37 5.07,46.14 6.31,46.14 v7.62,44.83 | 8.76,33.86 CN1.GND 10.51,33.38 11.86,33.38 v12.24,32.99 | S3.1 33.66,44.81 37.69,44.81 S3.2 38,44.73 38.15,44.58 40.89,44.58 C3.1 40.97,44.81 40.97,45.19 v41.5,45.72 | C30.1 28.32,23.09 26.42,23.09 FA-23816.0000MA30X-AG0.4 26.19,23.16 25.96,23.16 24.59,24.54 24.36,24.54 FA-23816.0000MA30X-AG0.2 24.13,24.69 22.22,24.69 C31.2 22,24.69 v21.08,24.69 | v20.85,34.98 21.54,35.66 21.84,35.66 R4.1 | J10.4 69.39,43.97 76.4,43.97 J10.3 76.48,44.2 76.48,51.05 J10.2 | J10.5 69.32,51.05 69.32,44.2 J10.4 | C22.1 C21.1 | 3.3VOK.C 33.05,13.18 33.05,10.29 36.7,6.63 37.16,6.63 IC6.3 37.39,6.78 37.77,7.16 39.52,7.16 C21.1 | 51.33,8 51.33,6.93 50.04,5.64 49.2,5.64 LED1.3 49.2,5.41 49.2,4.04 LED1.2 49.2,2.06 LED1.1 48.97,1.91 47.98,0.91 43.56,0.91 42.88,1.6 42.88,2.29 | 51.33,8 51.33,8.31 51.03,8.61 50.04,8.61 41.5,17.14 37.77,17.14 S2.1 | 42.88,2.29 42.88,4.04 39.9,7.01 C21.1 | 42.88,2.29 35.94,2.29 31.75,6.48 26.72,6.48 IC6.6 26.49,6.55 22.22,2.29 Z2.2 20.78,2.21 19.33,0.76 12.7,0.76 5.84,7.62 J3.1 | 51.33,8 55.07,8 55.68,8.61 55.68,16.99 54.76,17.91 DS1.11 54.61,18.06 52.07,18.06 50.95,18.06 49.96,19.05 C13.2 49.89,19.28 48.97,20.19 48.97,24.77 49.81,25.6 49.81,25.98 C10.2 49.96,26.21 49.96,28.19 C9.2 49.96,28.42 49.96,30.18 C8.2 49.96,30.4 49.96,32.23 C7.2 49.96,32.46 49.96,34.29 C1.2 50.04,34.52 50.04,35.81 58.12,43.89 69.09,43.89 J10.4
  Bottom 0.305: v43.18,25.4 44.63,23.95 44.63,20.95 48.17,17.41 v52.07,17.41 | v25.97,28.04 25.72,27.79 22.72,27.79 22.08,28.42 21.26,28.42 20.85,28.83 20.34,29.34 | v39.75,40.01 38.93,40.83 38.93,41.08
  Bottom 0.483: GND.TP 10.72,6.93 16.97,6.93 17.2,7.16 17.2,11.89 16.66,12.42 16.66,18.44 Q8.2 | J3.1 5.16,7.62 7.44,9.91 GND.TP | GND.TP 7.52,10.21 3.86,13.87 3.86,15.24 J3.3 4.09,15.32 6.45,15.32 13.31,22.17 20.4,22.17 | 40.51,45.72 40.51,44.81 C20.2 40.51,44.58 40.51,42.6 C23.2 40.28,42.44 38.93,41.08 34.95,37.11 29.01,37.11 28.02,38.1 24.13,38.1 21.08,35.05 v20.85,34.98 20.85,32.99 20.34,32.99 | 40.51,45.72 40.51,46.56 C4.2 40.51,46.79 40.51,48.62 C5.2 40.74,48.69 42.72,48.69 45.54,51.51 45.7,51.51 JP2.1 | 40.51,45.72 v41.5,45.72 | 20.85,24.69 20.85,22.78 20.4,22.33 20.4,22.17 | 20.85,24.69 20.85,28.83 | 20.34,29.34 20.34,32.99 | 20.4,22.17 20.4,20.73 18.41,18.75 R22.2 | v21.08,24.69 20.85,24.69 | 20.34,32.99 v12.24,32.99 11.54,33.7 10.39,33.7 7.62,36.47 v7.62,44.83 | U1.8 61.47,36.27 66.19,36.27 75.11,27.36 79.53,27.36 79.91,27.74 79.91,29.26 79.15,30.02 C2.1 78.99,31.7 76.4,34.29 76.25,34.29 U1.10 76.48,34.52 77.62,35.66 77.62,41.38 76.48,42.52 76.48,43.89 J10.3 | U1.1 61.39,22.33 58.88,22.33 54.61,18.06 DS1.11
  pour Bottom: 0,54.61 0,0 83.82,0 83.82,53.34 83.82,54.61
  pour Top: 83.82,54.61 83.82,0 0,0 0,53.34 0,54.61
IND_B  (via drill 0.3)
  Top 0.305: v38.23,15.77 45.24,8.76 45.24,7.62 R6.2 | v39.29,28.42 39.29,30.86 42.65,34.21 44.09,34.21 K3.63
  Bottom 0.305: v38.23,15.77 38.23,27.36 v39.29,28.42
IND_G  (via drill 0.3)
  Top 0.305: v32.66,23.85 33.27,24.46 33.27,28.88 32.97,29.18 32.36,29.18 K3.28 | v42.95,8.84 v37.08,14.71 | v46.46,5.33 46.46,5.11 45.16,3.81 LED1.5
  Bottom 0.305: v32.66,23.85 32.66,19.13 v37.08,14.71 | v46.46,5.33 v42.95,8.84
IND_R
  Top 0.305: R3.2 50.19,7.62 41.28,16.54 35.64,16.54 33.88,18.29 21.31,18.29 21.31,18.57 19.51,20.37 19.23,20.37 18.72,20.88 18.72,26.77 18.83,26.89 | 18.9,26.95 18.83,26.89 | K3.29 29.64,28.73 27.86,26.95 25.21,26.95 25.15,26.89 18.83,26.89
MCU_EN
  Top 0.152: 25.27,27.33 25.28,27.33 | IC5.3 27.41,28.88 27.41,27.33 25.4,27.33 25.28,27.33 | JP2.2 43.18,51.59 41.43,53.34 32.59,53.34 31.98,52.73 31.98,50.83 30.91,49.76 27.63,49.76 19.71,41.83 19.71,40.01 18.41,38.71 18.41,31.77 19.1,31.09 21.52,31.09 25.28,27.33
MCU_JTAG_TCLK  (via drill 0.3)
  Top 0.152: v29.84,31.39 29.69,31.24 28.78,31.24 IC5.8 | v31.06,32.16 32.21,32.16 32.28,32.23 K3.22 | v28.17,36.73 27.18,37.72 v27.18,42.6
  Bottom 0.152: v29.84,31.39 30.3,31.39 v31.06,32.16 30.99,32.16 30.99,33.91 v28.17,36.73 | v27.18,42.6 27.18,48.23 30.45,51.51 JP2.7
MCU_JTAG_TDI  (via drill 0.3)
  Top 0.152: v31.06,30.25 28.78,30.25 IC5.6 | K3.23 32.36,31.77 32.89,31.77 33.12,32 v33.5,32 33.5,36.8 30.07,40.23 v27.86,40.23 | v10.74,34.54 8.76,34.54 CN1.ID
  Bottom 0.152: v31.06,30.25 31.75,30.25 v33.5,32 | v10.74,34.54 10.74,34.42 14.5,34.42 20.7,40.62 JP3.1 20.7,40.54 21.01,40.23 v27.86,40.23 29.39,40.23 35.56,46.41 JP2.5
MCU_JTAG_TDO
  Top 0.152: IC5.9 27.94,32.08 30.15,32.08 30.99,31.24 K3.24 37.77,31.24 44.78,38.25 44.78,43.43 38.46,49.76 34.8,49.76 33.05,51.51 JP2.6
MCU_JTAG_TMS  (via drill 0.3)
  Top 0.152: IC5.7 28.78,30.71 30.53,30.71 30.76,30.94 31.6,30.94 31.75,30.79 32.28,30.79 K3.25 32.36,30.71 33.5,30.71 v33.66,30.56
  Bottom 0.152: v33.66,30.56 33.66,31.17 46.76,44.27 46.76,52.73 46.15,53.34 29.69,53.34 27.94,51.59 JP2.8
MCU_PROG  (via drill 0.3)
  Top 0.152: R14.2 31.9,42.82 32.05,42.67 33.58,42.67 S3.3 33.66,42.6 34.8,42.6 | 34.8,42.6 37.69,42.6 S3.4 | v30.84,38.02 27.79,34.98 26.64,34.98 26.42,34.75 26.42,33.45 27.41,32.46 27.41,32.08 IC5.10 | v34.8,42.67 34.8,42.6
  Bottom 0.152: v30.84,38.02 30.84,41.22 33.54,43.93 | 33.54,43.93 37.92,48.31 37.92,51.36 38.08,51.51 JP2.4 | 33.54,43.93 v34.8,42.67
MCU_RESET  (via drill 0.3)
  Top 0.152: v24.41,29.41 24.41,30.3 25.27,31.17 25.58,31.17 IC5.13 | v28.7,28.96 27.94,28.96 IC5.4 | R5.2 31.75,19.2 31.9,19.36 33.58,19.36 S2.4 33.66,19.36 34.95,19.36 | 34.95,19.36 37.69,19.36 S2.3 | 34.95,19.36 34.95,25.07 K3.34 34.95,25.15 34.95,25.6 v34.27,26.29 | v45.47,41.38 45.47,43.2 40.67,48.01 40.67,51.51 JP2.3
  Bottom 0.152: v24.41,29.41 28.25,29.41 v28.7,28.96 31.6,28.96 32.86,27.7 | v34.27,26.29 32.86,27.7 | v45.47,41.38 40.44,36.35 40.44,35.28 32.86,27.7
MISO  (via drill 0.3)
  Top 0.152: K3.52 44.7,28.73 v46.76,30.79 | v46.76,34.82 46.76,37.34 50.19,40.77 50.19,52.81 50.72,53.34 57.05,53.34 58.8,51.59 JP1.4
  Bottom 0.152: v46.76,34.82 v46.76,30.79 | U1.2 61.39,24.38 60.86,24.38 58.8,26.44 58.8,27.36 60.02,28.57 60.02,50.29 58.8,51.51 JP1.4
MOSI
  Top 0.152: 44.97,27.93 48.44,24.46 48.44,19.13 52.48,15.09 54.61,15.09 DS1.13 | 44.97,27.93 44.7,28.19 44.17,28.19 K3.51 | 44.97,27.93 47.45,30.4 47.45,33.91 56.21,42.67 56.21,51.51 JP1.3
  Bottom 0.152: U1.3 61.47,26.29 61.77,26.29 62.99,25.07 62.99,22.02 60.1,19.13 58.65,19.13 54.61,15.09 DS1.13
N$1
  Top 0.152: C1.1 53.39,34.29 54.61,33.07 DS1.1
N$2
  Top 0.305: R3.1 46.84,7.62 44.86,5.64 LED1.4
N$3
  Top 0.152: K3.19 32.36,33.76 32.89,33.76 33.2,34.06 33.2,36.65 31.14,38.71 28.78,38.71 28.55,38.48 Y2.2
N$4
  Top 0.152: BLM18AG601SN1D.1 C6.1 21.77,31.93 R21.2
N$5
  Top 0.152: C7.1 51.71,32.23 53.92,32.23 54.61,31.55 DS1.2
N$6
  Top 0.305: R6.1 43.56,7.62 43.56,6.55 43.49,6.48 43.49,3.12 44.55,2.06 44.78,2.06 LED1.6
N$7
  Bottom 0.152: 13.27,12.54 13.23,12.5 12.62,12.5 11.86,13.26 11.86,13.49 CR2.2 11.86,13.18 11.18,12.5 10.34,12.5 9.2,13.64 9.2,14.63 R7.2 | 13.27,12.54 14.45,13.72 14.45,19.43 Q8.3 | 13.27,12.54 13.31,12.5 13.31,10.13 13.92,9.53 LS1.2
N$8
  Bottom 0.305: U1.9 74.96,36.34 73.69,37.61 73.69,46.7 J10.1
N$9
  Top 0.152: C8.1 51.71,30.18 54.46,30.18 DS1.3
N$10
  Top 0.152: K3.17 31.75,34.75 31.14,34.14 27.18,34.14 C24.1
N$11
  Top 0.152: R60.1 37.08,13.18 35.1,13.18 3.3VOK.A
N$12
  Top 0.152: C9.1 54.3,28.19 54.61,28.5 DS1.4
N$13
  Top 0.152: C10.1 51.71,26.21 53.85,26.21 54.61,26.98 DS1.5
N$14
  Top 0.152: C13.1 54.15,19.05 54.61,19.51 DS1.10
N$15
  Top 0.152: C11.1 51.71,24.16 53.32,24.16 54.61,25.45 DS1.6
N$16
  Top 0.152: C11.2 49.96,24.08 50.27,24.08 50.95,23.39 54,23.39 54.61,24 DS1.7
N$17
  Top 0.152: C12.1 51.71,21.64 53.77,21.64 54.61,22.48 DS1.8
N$18
  Top 0.152: C12.2 49.96,21.57 50.27,21.57 51.03,20.8 54.46,20.8 54.61,20.95 DS1.9
N$21
  Top 0.152: R8.2 14.07,31.55 14.07,32.16 11.86,34.37 11.86,34.59 10.9,35.56 CN1.D+ 11.99,35.56 15.6,39.17 15.6,40.62 JP3.3
N$22
  Top 0.152: R16.1 14.45,33.53 15.29,32.69 16.43,32.69 18.11,34.37 18.11,40.62 JP3.2 18.03,40.62 16.21,42.44 15.21,42.44 14.35,41.58 14.35,38.84 11.91,36.4 8.8,36.4 CN1.D-
N$23  (via drill 0.3)
  Top 0.152: v21.77,29.72 20.02,29.72 18.26,31.47 15.9,31.47 R8.1 | v39.75,35.66 39.75,36.12 39.98,36.35 K3.5
  Bottom 0.152: v21.77,29.72 22.28,30.23 30.1,30.23 30.76,29.57 33.66,29.57 v39.75,35.66
N$24  (via drill 0.3)
  Top 0.152: v15.9,38.48 15.9,33.53 R16.2 | v30.07,41.91 36.17,41.91 39.45,38.63 39.45,36.96 K3.6
  Bottom 0.152: v15.9,38.48 15.9,38.71 17.12,39.93 17.12,41.83 17.73,42.44 26.34,42.44 26.87,41.91 v30.07,41.91
N$25
  Top 0.152: USBPOW.2 3.48,42.44 3.48,42.67 4.85,44.04 13.23,44.04 CR1.2
N$27
  Top 0.152: USBPOW.1 5,42.37 5,40.11 7,38.11 8.88,38.11 | CN1.VBUS 8.76,38 8.88,38.11 | JP3.4 11.4,40.64 8.88,38.11
N$30  (via drill 0.3)
  Top 0.152: R21.1 23.52,31.93 23.52,32.46 25.12,34.06 C18.1 24.97,33.83 v25.88,32.92 | v35.48,35.59 K3.14
  Bottom 0.152: v35.48,35.59 30.84,30.94 30.38,30.94 30.15,30.71 28.09,30.71 v25.88,32.92
N$35
  Bottom 0.152: R7.1 9.2,16.38 9.2,17.07 10.34,18.21 11.02,18.21 11.79,17.45 11.79,17.3 CR2.1 11.56,17.75 13.92,20.12 15.67,20.12 16.66,19.13 17.2,19.13 17.58,18.75 17.58,18.14 26.19,9.53 LS1.1 29.31,9.53 29.39,9.6 35.18,9.6 SJ1.2
N$36
  Top 0.762: D2.A2 9.73,5.71 9.73,7.7 D2.A1 9.35,7.85 7.44,7.85 3.86,11.43 J3.2
N$37  (via drill 0.3)
  Top 0.152: v29.54,33.3 32.28,33.3 K3.20 | v25.65,37.19 24.36,38.48 Y2.1
  Bottom 0.152: v25.65,37.19 v29.54,33.3
POWER_EN  (via drill 0.35)
  Top 0.152: R66.2 9.42,52.05 6.07,52.05 S4.3 5.99,51.97 5.31,51.28 2.79,51.28 1.88,50.37 1.88,45.11 v2.54,44.45 | IC6.1 37.16,3.28 36.93,3.28 30.3,9.91 30.3,10.9 23.67,17.53 21.53,17.53 20.93,18.13 20.93,18.42 19.36,19.99 19.07,19.99 18.34,20.72 18.34,21.22 v16.51,23.05
  Bottom 0.152: v2.54,44.45 2.54,27.53 2.31,27.29 2.31,26.05 3.19,25.17 12.93,25.17 15.24,22.86 16.32,22.86 v16.51,23.05
RADIO_CS  (via drill 0.3)
  Top 0.152: v43.18,38.1 42.04,36.96 K3.1 | v52.78,35.66 54.53,33.91 54.92,33.91 57.81,31.01 v57.81,30.48
  Bottom 0.152: U1.5 61.47,30.33 62.69,29.11 62.69,27.74 62.46,27.51 60.71,27.51 60.17,26.98 60.17,25.76 60.4,25.53 62.08,25.53 62.69,24.92 62.69,23.7 62.54,23.55 60.4,23.55 58.5,25.45 58.5,27.51 58.88,27.89 58.88,29.49 R57.1 58.8,29.49 v57.81,30.48 | v43.18,38.1 43.18,38.63 43.79,39.24 44.4,39.24 44.78,38.86 44.78,38.71 47.83,35.66 v52.78,35.66
RADIO_IRQ  (via drill 0.3)
  Top 0.152: v50.34,9.53 38.53,21.34 38.53,25.07 K3.41
  Bottom 0.152: v50.34,9.53 52.86,9.53 54.23,8.15 58.04,8.15 76.17,26.29 U1.14
RADIO_RESET  (via drill 0.3)
  Top 0.152: v62.84,33.38 62.46,33.76 v59.33,33.76 58.95,33.76 55.07,37.64 v53.09,37.64 | v45.47,39.01 45.47,38.48 36.86,29.87 33.35,29.87 33.05,30.18 32.36,30.18 K3.26
  Bottom 0.152: v59.33,33.76 58.04,33.76 R58.1 | v62.84,33.38 62.46,33.38 61.47,32.38 U1.6 | v45.47,39.01 51.71,39.01 v53.09,37.64
SCK  (via drill 0.3)
  Top 0.152: K3.50 44.7,27.74 48.13,24.31 48.13,18.97 53.54,13.56 54.61,13.56 DS1.14 | v59.49,18.44 v59.49,26.75 59.49,29.79 53.77,35.51 v53.77,35.66
  Bottom 0.152: v59.49,26.75 61.01,28.27 61.39,28.27 U1.4 | v59.49,18.44 54.61,13.56 DS1.14 | v53.77,35.66 53.77,51.51 JP1.2
SCL_3V
  Top 0.152: K3.37 36.47,29.03 49.89,42.44 49.89,52.96 50.57,53.65 61.77,53.65 63.83,51.59 JP1.6
  Bottom 0.152: JP1.6 63.53,51.21 63.53,45.82 R1.1
SDA_3V  (via drill 0.3)
  Top 0.152: v42.88,31.01 39.6,27.74 39.07,27.74 37.01,25.68 37.01,25.15 K3.38 | v49.51,41.07 v45.01,36.58
  Bottom 0.152: R2.1 61.85,51.05 JP1.5 59.56,53.34 53.32,53.34 52.71,52.73 52.71,50.9 49.51,47.7 v49.51,41.07 | v42.88,31.01 42.88,34.44 v45.01,36.58
VIN  (via drill 0.3)
  Top 0.762: 12.24,49.53 14.38,49.53 18.26,45.64 18.26,44.73 17.65,44.12 17.04,44.12 CR1.1 | 12.24,49.53 S4.2 | C21.2 39.75,5.49 37.77,5.49 37.24,4.95 IC6.2 36.93,5.18 36.25,5.18 34.19,7.24 v34.04,7.24 | 16.59,3.5 16.59,2.29 Z2.1 | 16.59,3.5 13.39,6.71 D2.K 13,6.93 6.68,13.26 3.17,13.26 0.89,15.54 0.89,51.36 2.72,53.19 11.86,53.19 12.24,52.81 12.24,49.53 | v17.2,4.04 16.89,3.73 16.59,3.5
  Bottom 0.762: VIN.TP 35.18,7.24 | 35.18,7.24 SJ1.3 | 35.18,7.24 v34.04,7.24 33.73,7.01 32.51,7.01 29.54,4.04 v17.2,4.04
X1
  Top 0.152: FA-23816.0000MA30X-AG0.1 26.42,24.69 26.57,24.84 C30.2 28.64,24.85 30.99,27.2 32.28,27.2 K3.32
X2
  Top 0.152: C31.1 22.22,23.01 24.13,23.01 FA-23816.0000MA30X-AG0.3 24.21,23.01 25.04,22.17 31.98,22.17 34.42,24.61 34.42,25.07 K3.33

### Text on the board
tPlace: TLM | Power | TMS | TCK | TDO | TDI | PRG | RST | EN | G | CS | SCK | MOSI | MISO | SDA | SCL | ZENITH Launch Controller V1 | PROG | Designed by Aaron Becker | USB_EN | VUSB | D+ | D- | ID | MCU | 3.3V | Display Here :) | Rx | Tx | RST | GND | Batt+ | IND | Batt-
bPlace: Powered by magik and caffeine :) | A_